# Altium schematic sheet RX Balun.SchDoc
size A
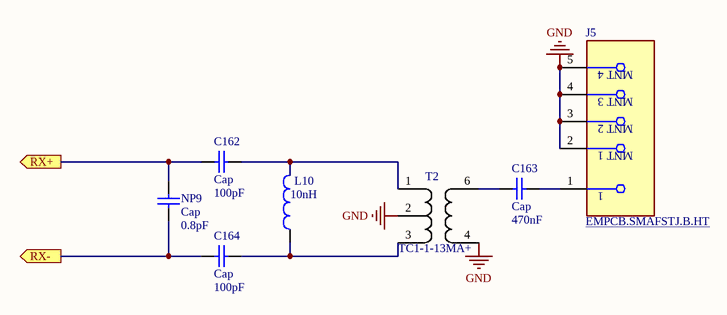
[diagram p0: RX Balun.SchDoc]

## Parts
C162  Cap  value 100pF  [0402-A]
C163  Cap  value 470nF  [0402-A]
C164  Cap  value 100pF  [0402-A]
J5  EMPCB.SMAFSTJ.B.HT  [FP-EMPCB_SMAFSTJ_B_HT-MFG]
L10  value 10nH  [1608[0603]]  (hidden comment: Inductor)
NP9  Cap  value 0.8pF  [0402-A]
T2  TC1-1-13MA+  [TC1-1-13MA+]

## Ports
RX+ (out), RX- (out)

## Nets
GND: J5.2(MNT_1) J5.3(MNT_2) J5.4(MNT_3) J5.5(MNT_4) T2.2 T2.4
RX+: C162.1 NP9.1 ; port RX+
RX-: C164.1 NP9.2 ; port RX-
NetC162_2: C162.2 L10.2 T2.1
NetC163_1: C163.1 T2.6
NetC163_2: C163.2 J5.1
NetC164_2: C164.2 L10.1 T2.3

## Library data of the parts
C162-C164 NP9 = Cap: Capacitor; Published: 8-Jun-2000; LatestRevisionDate: 17-Jul-2002; LatestRevisionNote: Re-released for DXP Platform.; PackageReference: RAD-0.3; Publisher: Altium Limited; PackageDescription: Radial Cap, Thru-Hole; 2 Leads; 0.3 in Pin Spacing
J5 = CMP-111093-000001-1: CONN SMA JACK STR 50OHM EDGE MNT; Manufacturer: Taoglas Limited; Conn Orientation: Horizontal; Frequency: 12.4GHz; Impedance: 50Ω; Voltage Rating: 335V; Is Female: yes; Pitch: 2.62mm; Number Of Contacts: 1; Device Class L2: RF / Coaxial Connectors; Category: Conn; Contact Material: Gold; Device Class L1: Connectors; Digikey Description: CONN SMA JACK STR 50OHM EDGE MNT; Temperature Range Low: -40°C; Octopart: https://octopart.com/empcb.smafstj.b.ht-taoglas-24204431; ComponentLink2URL: https://cdn.taoglas.com/datasheets/EMPCB.SMAFSTJ.B.HT.pdf; Temperature Range High: +85°C; Device Class L3: unset; Temperature: -40°C to +85°C; Package: 0; RoHS: TRUE; Lead Free: Yes; Automotive: No; ComponentLink2Description: Datasheet; Mouser Description: RF Connectors / Coaxial Connectors SMA Straight Edge Mount PCB Jack-Gold; Manufacturer Part Number: EMPCB.SMAFSTJ.B.HT
L10 = Inductor: Code_IEC: 1005; Published: 8-Jun-2000; LatestRevisionDate: 29-May-2009; LatestRevisionNote: IPC-7351 Footprint Added.; PackageReference: 0402-A; Publisher: Altium Limited; PackageDescription: Chip Inductor; Code_JEITA: 0402